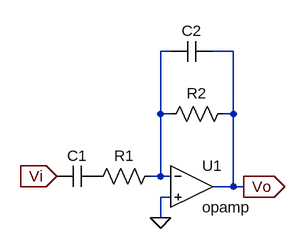
[diagram p0: schematic 2d1.asc]
2d1.asc, the LTspice schematic file:
Version 4
SHEET 1 880 680
WIRE 288 -112 272 -112
WIRE 384 -112 352 -112
WIRE 272 -16 272 -112
WIRE 288 -16 272 -16
WIRE 384 -16 384 -112
WIRE 384 -16 368 -16
WIRE 272 80 272 -16
WIRE 272 80 256 80
WIRE 288 80 272 80
WIRE 384 96 384 -16
WIRE 384 96 352 96
WIRE 400 96 384 96
WIRE 288 112 272 112
WIRE 272 144 272 112
FLAG 112 80 Vi
IOPIN 112 80 In
FLAG 272 144 0
FLAG 400 96 Vo
IOPIN 400 96 Out
SYMBOL cap 176 64 R90
WINDOW 0 0 32 VBottom 2
WINDOW 3 32 32 Invisible 2
SYMATTR InstName C1
SYMBOL res 272 64 R90
WINDOW 0 0 56 VBottom 2
WINDOW 3 32 56 Invisible 2
SYMATTR InstName R1
SYMBOL Opamps\\opamp 320 32 R0
SYMATTR InstName U1
SYMBOL res 384 -32 R90
WINDOW 0 0 56 VBottom 2
WINDOW 3 32 56 Invisible 2
SYMATTR InstName R2
SYMBOL cap 352 -128 R90
WINDOW 0 0 32 VBottom 2
WINDOW 3 32 32 Invisible 2
SYMATTR InstName C2

The netlist it stands for:
* 2d1.asc
C1 P001 Vi C
R1 N001 P001 R
XU1 N001 0 Vo opamp Aol=100K GBW=10Meg  ; pins invin noninvin out
R2 Vo N001 R
C2 Vo N001 C
.backanno
.end